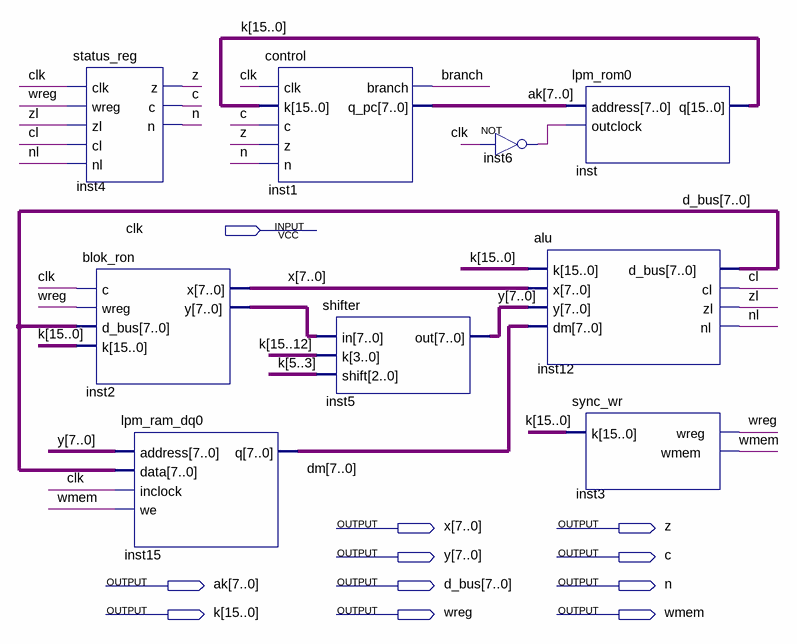
[diagram p0: schematic sheet]
// Quartus schematic cpu.bdf as structural Verilog: 9 symbols, 11 pins
module cpu (
  input  clk,
  output [7:0] x,
  output z,
  output [7:0] y,
  output c,
  output [7:0] ak,
  output [7:0] d_bus,
  output n,
  output [15:0] k,
  output wreg,
  output wmem
);

  wire branch, cl, inst6_out, nl, zl;
  wire [7:0] dm, inst2_y;

  status_reg inst4 (.clk(clk), .wreg(wreg), .zl(zl), .cl(cl), .nl(nl), .z(z), .c(c), .n(n));
  blok_ron inst2 (.c(clk), .wreg(wreg), .d_bus(d_bus), .k(k), .x(x), .y(inst2_y));
  lpm_ram_dq0 inst15 (.address(y), .data(d_bus), .inclock(clk), .we(wmem), .q(dm));
  control inst1 (.clk(clk), .k(k), .c(c), .z(z), .n(n), .branch(branch), .q_pc(ak));
  shifter inst5 (.in(inst2_y), .k(k[15:12]), .shift(k[5:3]), .out(y));
  not inst6 (inst6_out, clk);
  alu inst12 (.k(k), .x(x), .y(y), .dm(dm), .d_bus(d_bus), .cl(cl), .zl(zl), .nl(nl));
  lpm_rom0 inst (.address(ak), .outclock(inst6_out), .q(k));
  sync_wr inst3 (.k(k), .wreg(wreg), .wmem(wmem));
endmodule
